# Altium schematic sheet cm5.SchDoc
size 594 x 420 mm; Address1: Address1; Address2: Address2; Address3: Address3; Address4: Address4; DocumentNumber: 1; SheetNumber: 1; SheetTotal: 6; Перв_применение: Э3
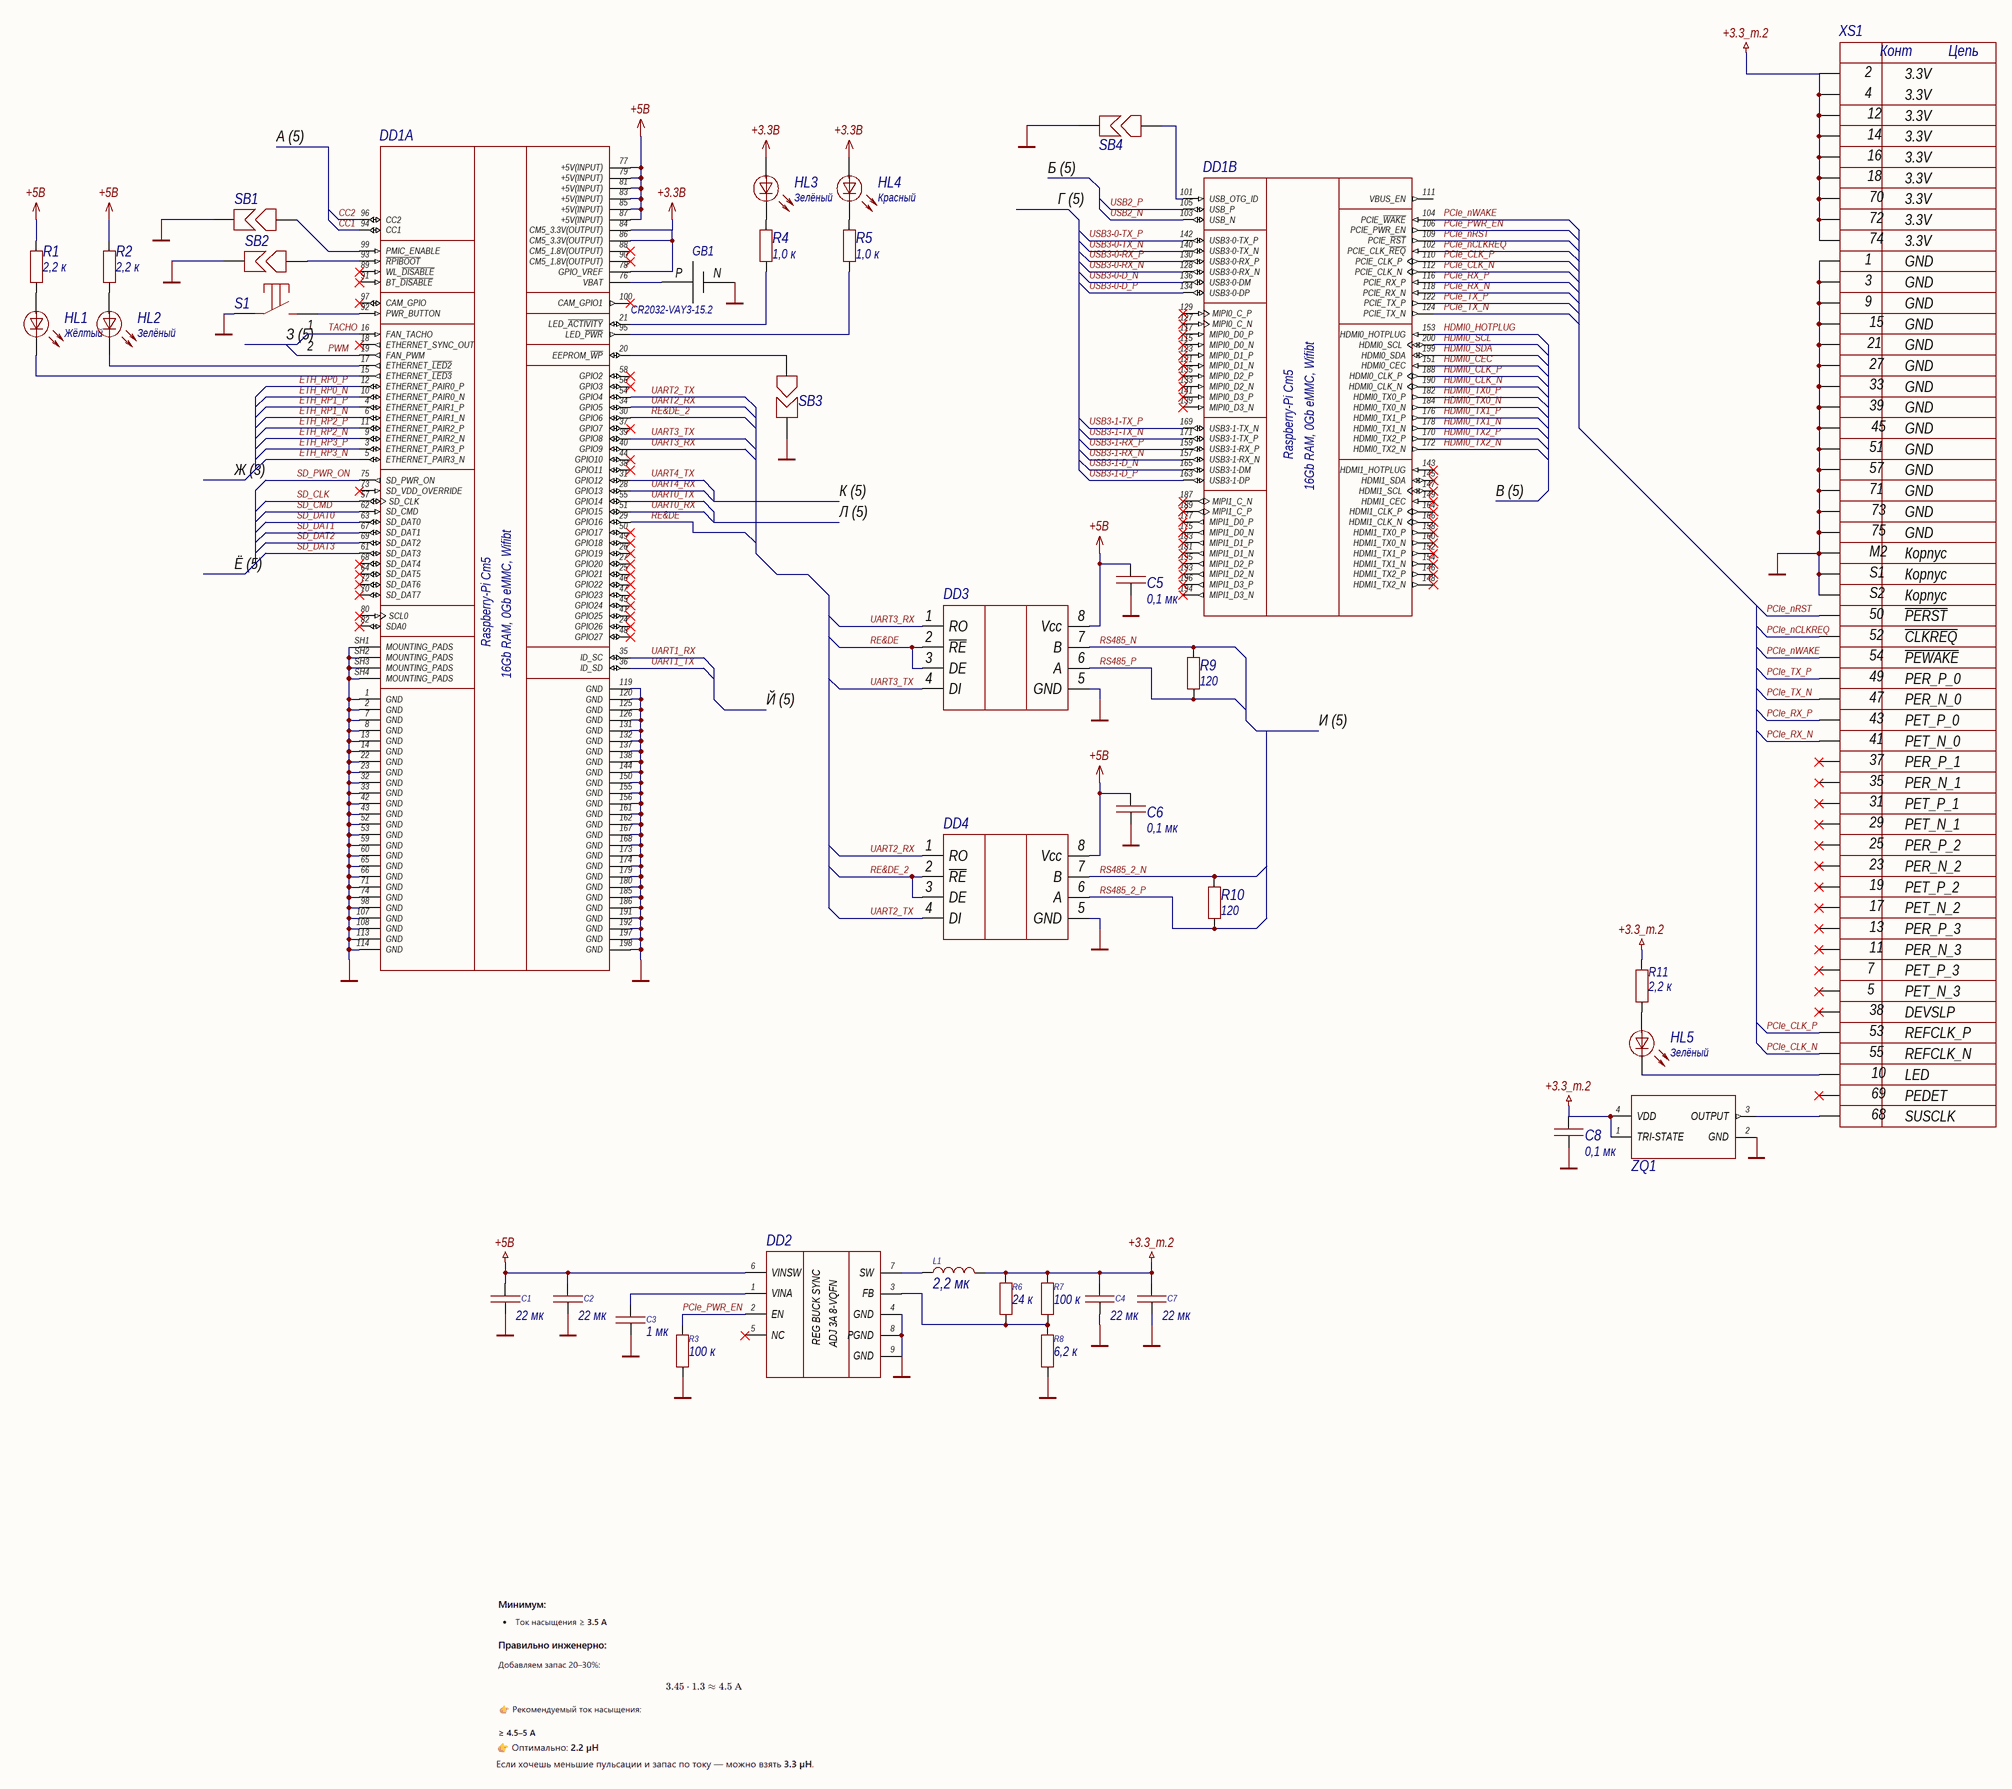
[diagram p0: cm5.SchDoc]

## Parts
C1  value 22 мк  [1210C]  (hidden comment: Capacitor)
C2  value 22 мк  [1210C]  (hidden comment: Capacitor)
C3  value 1 мк  [0603C]  (hidden comment: Capacitor)
C4  value 22 мк  [1210C]  (hidden comment: Capacitor)
C5  value 0,1 мк  [0603C]  (hidden comment: Capacitor)
C6  value 0,1 мк  [0603C]  (hidden comment: Capacitor)
C7  value 22 мк  [1210C]  (hidden comment: Capacitor)
C8  value 0,1 мк  [0603C]  (hidden comment: Capacitor)
DD1  CM5116000  [CM5116000]  (value not drawn)  (parts A,B of 2)
DD2  ST1S40IPUR  [VFQFPN8-4X4]  (value not drawn)
DD3  MAX485CSA  [SOIC-8]  (value not drawn)
DD4  MAX485CSA  [SOIC-8]  (value not drawn)
GB1  CR2032-VAY3-15.2  [CR2032-VAY3-15.2]
HL1  value Жёлтый  [0603D_yellow]  (hidden comment: LED 0603 YELLOW)
HL2  value Зелёный  [0603D_green]  (hidden comment: LED 0603 GREEN)
HL3  value Зелёный  [0603D_green]  (hidden comment: LED 0603 GREEN)
HL4  value Красный  [0603D_red]  (hidden comment: LED 0603 RED)
HL5  value Зелёный  [0603D_green]  (hidden comment: LED 0603 GREEN)
L1  value 2,2 мк  [IHLP-2020]  (hidden comment: IHLP2020BZER2R2M01)
R1  value 2,2 к  [0603R]  (hidden comment: Resistor)
R2  value 2,2 к  [0603R]  (hidden comment: Resistor)
R3  value 100 к  [0603R]  (hidden comment: Resistor)
R4  value 1,0 к  [0603R]  (hidden comment: Resistor)
R5  value 1,0 к  [0603R]  (hidden comment: Resistor)
R6  value 24 к  [0603R]  (hidden comment: Resistor)
R7  value 100 к  [0603R]  (hidden comment: Resistor)
R8  value 6,2 к  [0603R]  (hidden comment: Resistor)
R9  value 120  [1206R]  (hidden comment: Resistor)
R10  value 120  [1206R]  (hidden comment: Resistor)
R11  value 2,2 к  [0603R]  (hidden comment: Resistor)
S1  TSS-TD-19XA-XTR  [TSS-TD-19XA-XTR]  (value not drawn)
SB1  SB  [0603SB]  (value not drawn)  (net tie, no BOM)
SB2  SB  [0603SB]  (value not drawn)  (net tie, no BOM)
SB3  SB  [0603SB]  (value not drawn)  (net tie, no BOM)
SB4  SB  [0603SB]  (value not drawn)  (net tie, no BOM)
XS1  123A-30M00  [123A-30M00]  (value not drawn)
ZQ1  ASEK-32.768KHZ-LRT  [XTAL_ASEK-32.768KHZ-LRT]  (value not drawn)

## Nets
+3.3_m.2: C4.2 C7.2 C8.2 L1.2 R6.2 R7.2 R11.2 XS1.2(3.3V) XS1.4(3.3V) XS1.12(3.3V) XS1.14(3.3V) XS1.16(3.3V) XS1.18(3.3V) XS1.70(3.3V) XS1.72(3.3V) XS1.74(3.3V) ZQ1.1(TRI-STATE) ZQ1.4(VDD)
+3.3В: DD1.78(GPIO_VREF) DD1.84(CM5_3.3V(OUTPUT)) DD1.86(CM5_3.3V(OUTPUT)) HL3.1 HL4.1
+5В: C1.2 C2.2 C5.2 C6.2 DD1.77(+5V(INPUT)) DD1.79(+5V(INPUT)) DD1.81(+5V(INPUT)) DD1.83(+5V(INPUT)) DD1.85(+5V(INPUT)) DD1.87(+5V(INPUT)) DD2.6(VINSW) DD3.8(Vcc) DD4.8(Vcc) R1.2 R2.2
GND: C1.1 C2.1 C3.1 C4.1 C5.1 C6.1 C7.1 C8.1 DD1.1(GND) DD1.2(GND) DD1.7(GND) DD1.8(GND) DD1.13(GND) DD1.14(GND) DD1.22(GND) DD1.23(GND) DD1.32(GND) DD1.33(GND) DD1.42(GND) DD1.43(GND) DD1.52(GND) DD1.53(GND) DD1.59(GND) DD1.60(GND) DD1.65(GND) DD1.66(GND) DD1.71(GND) DD1.74(GND) DD1.98(GND) DD1.107(GND) DD1.108(GND) DD1.113(GND) DD1.114(GND) DD1.119(GND) DD1.120(GND) DD1.125(GND) DD1.126(GND) DD1.131(GND) DD1.132(GND) DD1.137(GND) DD1.138(GND) DD1.144(GND) DD1.150(GND) DD1.155(GND) DD1.156(GND) DD1.161(GND) DD1.162(GND) DD1.167(GND) DD1.168(GND) DD1.173(GND) DD1.174(GND) DD1.179(GND) DD1.180(GND) DD1.185(GND) DD1.186(GND) DD1.191(GND) DD1.192(GND) DD1.197(GND) DD1.198(GND) DD1.SH1(MOUNTING_PADS) DD1.SH2(MOUNTING_PADS) DD1.SH3(MOUNTING_PADS) DD1.SH4(MOUNTING_PADS) DD2.4(GND) DD2.8(PGND) DD2.9(GND) DD3.5(GND) DD4.5(GND) GB1.N R3.1 R8.1 S1.1 SB1.2 SB2.2 SB3.2 SB4.2 XS1.1(GND) XS1.3(GND) XS1.9(GND) XS1.15(GND) XS1.21(GND) XS1.27(GND) XS1.33(GND) XS1.39(GND) XS1.45(GND) XS1.51(GND) XS1.57(GND) XS1.71(GND) XS1.73(GND) XS1.75(GND) XS1.M2(Корпус) XS1.S1(Корпус) XS1.S2(Корпус) ZQ1.2(GND)
CC1: DD1.94(CC1)
CC2: DD1.96(CC2)
ETH_RP0_N: DD1.10(ETHERNET_PAIR0_N)
ETH_RP0_P: DD1.12(ETHERNET_PAIR0_P)
ETH_RP1_N: DD1.6(ETHERNET_PAIR1_N)
ETH_RP1_P: DD1.4(ETHERNET_PAIR1_P)
ETH_RP2_N: DD1.9(ETHERNET_PAIR2_N)
ETH_RP2_P: DD1.11(ETHERNET_PAIR2_P)
ETH_RP3_N: DD1.5(ETHERNET_PAIR3_N)
ETH_RP3_P: DD1.3(ETHERNET_PAIR3_P)
HDMI0_CEC: DD1.151(HDMI0_CEC)
HDMI0_CLK_N: DD1.190(HDMI0_CLK_N)
HDMI0_CLK_P: DD1.188(HDMI0_CLK_P)
HDMI0_HOTPLUG: DD1.153(HDMI0_HOTPLUG)
HDMI0_SCL: DD1.200(HDMI0_SCL)
HDMI0_SDA: DD1.199(HDMI0_SDA)
HDMI0_TX0_N: DD1.184(HDMI0_TX0_N)
HDMI0_TX0_P: DD1.182(HDMI0_TX0_P)
HDMI0_TX1_N: DD1.178(HDMI0_TX1_N)
HDMI0_TX1_P: DD1.176(HDMI0_TX1_P)
HDMI0_TX2_N: DD1.172(HDMI0_TX2_N)
HDMI0_TX2_P: DD1.170(HDMI0_TX2_P)
PCIe_CLK_N: DD1.112(PCIE_CLK_N) XS1.55(REFCLK_N)
PCIe_CLK_P: DD1.110(PCIE_CLK_P) XS1.53(REFCLK_P)
PCIe_nCLKREQ: DD1.102(PCIE_CLK_~{REQ}) XS1.52(~{CLKREQ})
PCIe_nRST: DD1.109(PCIE_~{RST}) XS1.50(~{PERST})
PCIe_nWAKE: DD1.104(PCIE_~{WAKE}) XS1.54(~{PEWAKE})
PCIe_PWR_EN: DD1.106(PCIE_PWR_EN) DD2.2(EN) R3.2
PCIe_RX_N: DD1.118(PCIE_RX_N) XS1.41(PET_N_0)
PCIe_RX_P: DD1.116(PCIE_RX_P) XS1.43(PET_P_0)
PCIe_TX_N: DD1.124(PCIE_TX_N) XS1.47(PER_N_0)
PCIe_TX_P: DD1.122(PCIE_TX_P) XS1.49(PER_P_0)
PWM: DD1.19(FAN_PWM)
RE&DE: DD1.29(GPIO16) DD3.2(~{RE}) DD3.3(DE)
RE&DE_2: DD1.30(GPIO6) DD4.2(~{RE}) DD4.3(DE)
RS485_2_N: DD4.7(B) R10.2
RS485_2_P: DD4.6(A) R10.1
RS485_N: DD3.7(B) R9.2
RS485_P: DD3.6(A) R9.1
SD_CLK: DD1.57(SD_CLK)
SD_CMD: DD1.62(SD_CMD)
SD_DAT0: DD1.63(SD_DAT0)
SD_DAT1: DD1.67(SD_DAT1)
SD_DAT2: DD1.69(SD_DAT2)
SD_DAT3: DD1.61(SD_DAT3)
SD_PWR_ON: DD1.75(SD_PWR_ON)
TACHO: DD1.16(FAN_TACHO)
UART0_RX: DD1.51(GPIO15)
UART0_TX: DD1.55(GPIO14)
UART1_RX: DD1.35(ID_SC)
UART1_TX: DD1.36(ID_SD)
UART2_RX: DD1.34(GPIO5) DD4.1(RO)
UART2_TX: DD1.54(GPIO4) DD4.4(DI)
UART3_RX: DD1.40(GPIO9) DD3.1(RO)
UART3_TX: DD1.39(GPIO8) DD3.4(DI)
UART4_RX: DD1.28(GPIO13)
UART4_TX: DD1.31(GPIO12)
USB2_N: DD1.103(USB_N)
USB2_P: DD1.105(USB_P)
USB3-0-D_N: DD1.136(USB3-0-DM)
USB3-0-D_P: DD1.134(USB3-0-DP)
USB3-0-RX_N: DD1.128(USB3-0-RX_N)
USB3-0-RX_P: DD1.130(USB3-0-RX_P)
USB3-0-TX_N: DD1.140(USB3-0-TX_N)
USB3-0-TX_P: DD1.142(USB3-0-TX_P)
USB3-1-D_N: DD1.165(USB3-1-DM)
USB3-1-D_P: DD1.163(USB3-1-DP)
USB3-1-RX_N: DD1.157(USB3-1-RX_N)
USB3-1-RX_P: DD1.159(USB3-1-RX_P)
USB3-1-TX_N: DD1.171(USB3-1-TX_P)
USB3-1-TX_P: DD1.169(USB3-1-TX_N)
NetC3_2: C3.2 DD2.1(VINA)
NetDD1_15: DD1.15(ETHERNET_~{LED3}) HL1.2
NetDD1_17: DD1.17(ETHERNET_~{LED2}) HL2.2
NetDD1_20: DD1.20(EEPROM_~{WP}) SB3.1
NetDD1_21: DD1.21(LED_~{ACTIVITY}) R4.2
NetDD1_76: DD1.76(VBAT) GB1.P
NetDD1_92: DD1.92(PWR_BUTTON) S1.2
NetDD1_93: DD1.93(~{RPIBOOT}) SB2.1
NetDD1_95: DD1.95(LED_~{PWR}) R5.2
NetDD1_99: DD1.99(PMIC_ENABLE) SB1.1
NetDD1_101: DD1.101(USB_OTG_ID) SB4.1
NetDD2_3: DD2.3(FB) R6.1 R7.1 R8.2
NetDD2_7: DD2.7(SW) L1.1
NetHL1_1: HL1.1 R1.1
NetHL2_1: HL2.1 R2.1
NetHL3_2: HL3.2 R4.1
NetHL4_2: HL4.2 R5.1
NetHL5_1: HL5.1 R11.1
NetHL5_2: HL5.2 XS1.10(LED)
NetXS1_68: XS1.68(SUSCLK) ZQ1.3(OUTPUT)

Not connected (* = marked no-connect by the designer): DD1 18(ETHERNET_SYNC_OUT)* 24(GPIO26)* 25(GPIO21)* 26(GPIO19)* 27(GPIO20)* 37(GPIO7)* 38(GPIO11)* 41(GPIO25)* 44(GPIO10)* 45(GPIO24)* 46(GPIO22)* 47(GPIO23)* 48(GPIO27)* 49(GPIO18)* 50(GPIO17)* 56(GPIO3)* 58(GPIO2)* 64(SD_DAT5)* 68(SD_DAT4)* 70(SD_DAT7)* 72(SD_DAT6)* 73(SD_VDD_OVERRIDE)* 80(SCL0)* 82(SDA0)* 88(CM5_1.8V(OUTPUT))* 89(WL_~{DISABLE})* 90(CM5_1.8V(OUTPUT))* 91(BT_~{DISABLE})* 97(CAM_GPIO)* 100(CAM_GPIO1)* 111(VBUS_EN) 115(MIPI0_D0_N)* 117(MIPI0_D0_P)* 121(MIPI0_D1_N)* 123(MIPI0_D1_P)* 127(MIPI0_C_N)* 129(MIPI0_C_P)* 133(MIPI0_D2_N)* 135(MIPI0_D2_P)* 139(MIPI0_D3_N)* 141(MIPI0_D3_P)* 143(HDMI1_HOTPLUG)* 145(HDMI1_SDA)* 146(HDMI1_TX2_P)* 147(HDMI1_SCL)* 148(HDMI1_TX2_N)* 149(HDMI1_CEC)* 152(HDMI1_TX1_P)* 154(HDMI1_TX1_N)* 158(HDMI1_TX0_P)* 160(HDMI1_TX0_N)* 164(HDMI1_CLK_P)* 166(HDMI1_CLK_N)* 175(MIPI1_D0_N)* 177(MIPI1_D0_P)* 181(MIPI1_D1_N)* 183(MIPI1_D1_P)* 187(MIPI1_C_N)* 189(MIPI1_C_P)* 193(MIPI1_D2_N)* 194(MIPI1_D3_N)* 195(MIPI1_D2_P)* 196(MIPI1_D3_P)*; DD2 5(NC)*; XS1 5(PET_N_3)* 7(PET_P_3)* 11(PER_N_3)* 13(PER_P_3)* 17(PET_N_2)* 19(PET_P_2)* 23(PER_N_2)* 25(PER_P_2)* 29(PET_N_1)* 31(PET_P_1)* 35(PER_N_1)* 37(PER_P_1)* 38(DEVSLP)* 69(PEDET)*

## Notes on the sheet
- А (5)
- (near SB4) Б (5)
- Г (5)
- (near S1) З (5)
- (near S1) 1
- (near S1) 2
- Ж (3)
- К (5)
- Л (5)
- В (5)
- Ё (5)
- Й (5)
- И (5)
- Перв. примен.
- Справ. №
- Подп. и дата
- Инв. № дубл.
- Взам. инв. №
- Разраб.
- Изм.
- Лист
- № докум.
- Подп.
- Дата
- Лит.
- Масса
- Масштаб
- Пров.
- Т.контр.
- Схема электрическая принципиальная
- Листов
- Инв. № подл.
- Утв.
- Н.контр.
- Копировал
- Формат А2
- МГТУ им. Н. Э. Баумана
  Кафедра ИУ4
  Группа РТ2-81Б
- (in symbol 123A-30M00) Конт; Цепь
- (in symbol CM5116000, part A) Raspberry-Pi Cm5; 16Gb RAM, 0Gb eMMC, Wifibt
- (in symbol CM5116000, part B) Raspberry-Pi Cm5; 16Gb RAM, 0Gb eMMC, Wifibt
- (in symbol ST1S40IPUR) REG BUCK SYNC; ADJ 3A 8-VQFN

## Library data of the parts
C1 C2 C4 C7 = Capacitor_22u_10_25V_X7R_1210C: Конденсатор 1210C ёмкостью 22 мк 10%, 25 В, X7R; Voltage (V): 25; Capacity (nF): 22000; Part Number: Capacitor_22u_10_25V_X7R_1210C; Tolerance: 10%; Dielectric: X7R
C3 = Capacitor_1u_10_50V_X7R_0603C: Конденсатор 0603C ёмкостью 1 мк 10%, 50 В, X7R; Voltage (V): 50; Capacity (nF): 1000; Part Number: Capacitor_1u_10_50V_X7R_0603C; Tolerance: 10%; Dielectric: X7R
C5 C6 C8 = Capacitor_0,1u_10_50V_X7R_0603C: Конденсатор 0603C ёмкостью 0,1 мк 10%, 50 В, X7R; Voltage (V): 50; Capacity (nF): 100; Part Number: Capacitor_0,1u_10_50V_X7R_0603C; Tolerance: 10%; Dielectric: X7R
DD1 = CM5116000: Raspberry-Pi Cm5 16Gb RAM, 0Gb eMMC, Wifibt; MF: Raspberry Pi; MP: CM5108064B; Автор: rreali; SnapEDA_Link: https://www.snapeda.com/parts/CM5108064B/Raspberry+Pi/view-part/?ref=snap; Package: None; Value: *; Check_prices: https://www.snapeda.com/parts/CM5108064B/Raspberry+Pi/view-part/?ref=eda; Part Number: CM5116000; Datasheet: https://pip-assets.raspberrypi.com/categories/944-raspberry-pi-compute-module-5/documents/RP-008180-DS-6-cm5-datasheet.pdf?disposition=inline
DD2 = ST1S40IPUR: Преобразователь постоянного тока понижающий синхронный подстраиваемый 3А; MF: STMicroelectronics; Автор: rreali; SnapEDA_Link: https://www.snapeda.com/parts/ST1S40IPUR/STMicroelectronics/view-part/?ref=snap; Package: VDFN-8 STMicroelectronics; Value: *; MP: ST1S40IPUR; Check_prices: https://www.snapeda.com/parts/ST1S40IPUR/STMicroelectronics/view-part/?ref=eda; Part Number: ST1S40IPUR; Datasheet: https://cdn.promelec.ru/upload/datasheet/6/4/CD00284753.pdf
DD3 DD4 = MAX485CSA: RS-485 приёмопередатчик; Part Number: MAX485CSA
GB1 = CR2032-VAY3-15.2: Li, MnO2 батарея типоразмера R20, 3В, 0.22Ач, приваренные выводы, -20...60 °C; Автор: rreali; Part Number: CR2032-VAY3-15.2
HL1 = LED 0603 YELLOW: Светодиод 0603 Жёлтый; Автор: rreali; Part Number: LED 0603 YELLOW
HL2 HL3 HL5 = LED 0603 GREEN: Светодиод 0603 Зелёный; Автор: rreali; Part Number: LED 0603 GREEN
HL4 = LED 0603 RED: Светодиод 0603 Красный; Автор: rreali; Part Number: LED 0603 RED
L1 = IHLP2020BZER2R2M01: Катушка индуктивности SMD экранированная 2,2мкГн ±20% 4,2A 50,1мОм 2020 лента на катушке; Inductance (μH): 2,2; Current: 4,5 А; Автор: rreali; Part Number: IHLP2020BZER2R2M01; Datasheet: https://cdn.promelec.ru/upload/datasheet/0/8/ihlp-2020bz-01.pdf
R1 R2 R11 = Resistor_2.2k_1_0603: Резистор номиналом 2,2 кОм 1%; Power: *; Part Number: Resistor_2.2k_1_0603; Tolerance: 1%
R3 R7 = Resistor_100k_1_0603: Резистор номиналом 100 кОм 1%; Power: *; Part Number: Resistor_100k_1_0603; Tolerance: 1%
R4 R5 = Resistor_1.0k_1_0603: Резистор номиналом 1,0 кОм 1%; Power: *; Part Number: Resistor_1.0k_1_0603; Tolerance: 1%
R6 = Resistor_24k_1_0603: Резистор номиналом 24 кОм 1%; Power: *; Part Number: Resistor_24k_1_0603; Tolerance: 1%
R8 = Resistor_6.2k_1_0603: Резистор номиналом 6,2 кОм 1%; Power: *; Part Number: Resistor_6.2k_1_0603; Tolerance: 1%
R9 R10 = Resistor_120_1_0603: Резистор номиналом 120 Ом 1%; Power: *; Part Number: Resistor_120_1_0603; Tolerance: 1%
S1 = TSS-TD-19XA-XTR: Тактовая кнопка; Автор: glebmih; Part Number: TSS-TD-19XA-XTR; Datasheet: https://cdn.promelec.ru/upload/items/2023/04/17/TSS-TD-19XA.pdf
SB1-SB4 = SB: Solder bridge, мост припоя, запаиваемая перемычка, net tie, jumper; Автор: rreali; Part Number: SB
XS1 = 123A-30M00: Разъем: M.2 (NGFF); горизонтальный; SMT; gold flash; PIN: 67; 0,5А; System: Connector; Автор: rreali; Part Number: 123A-30M00; Datasheet: https://static.chipdip.ru/lib/882/DOC040882845.pdf
ZQ1 = ASEK-32.768KHZ-LRT: Генератор кварцевый керамика 32.768кГц ±25ppm/°С -40°C....+85В°C SMT; Автор: rreali; Value: 32.768кГц; Availability: Unavailable; Price: None; Package: None; MP: ASEK-32.768KHZ-LRT; Part Number: ASEK-32.768KHZ-LRT